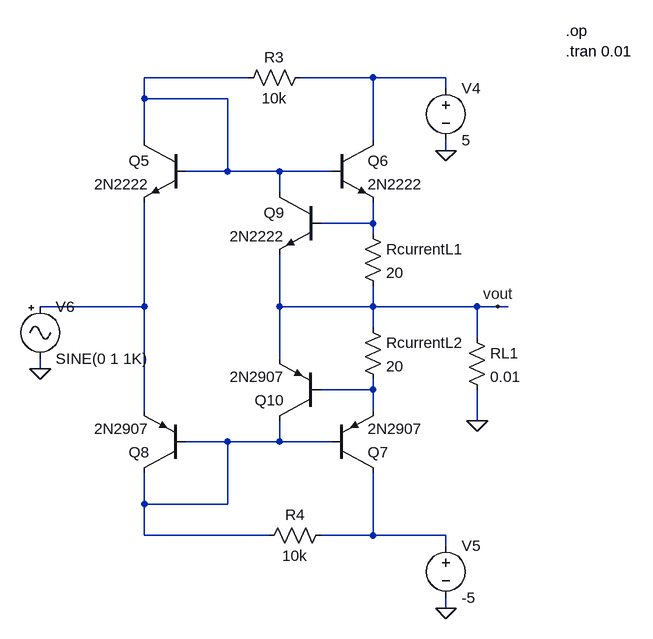
[diagram p0: schematic AB push-pull amplifier.asc]
AB push-pull amplifier.asc, the LTspice schematic file:
Version 4
SHEET 1 1848 848
WIRE 1248 0 1088 0
WIRE 1440 0 1328 0
WIRE 1552 0 1440 0
WIRE 1552 16 1552 0
WIRE 1088 32 1088 0
WIRE 1216 32 1088 32
WIRE 1088 96 1088 32
WIRE 1440 96 1440 0
WIRE 1552 112 1552 96
WIRE 1216 144 1216 32
WIRE 1216 144 1152 144
WIRE 1296 144 1216 144
WIRE 1376 144 1296 144
WIRE 1296 176 1296 144
WIRE 1440 224 1440 192
WIRE 1440 224 1360 224
WIRE 1440 240 1440 224
WIRE 1088 352 1088 192
WIRE 1088 352 928 352
WIRE 1296 352 1296 272
WIRE 1440 352 1440 320
WIRE 1440 352 1296 352
WIRE 1600 352 1440 352
WIRE 1632 352 1600 352
WIRE 1648 352 1632 352
WIRE 1440 384 1440 352
WIRE 1600 400 1600 352
WIRE 1296 432 1296 352
WIRE 928 448 928 432
WIRE 1440 480 1440 464
WIRE 1440 480 1360 480
WIRE 1088 512 1088 352
WIRE 1440 512 1440 480
WIRE 1600 528 1600 480
WIRE 1216 560 1152 560
WIRE 1296 560 1296 528
WIRE 1296 560 1216 560
WIRE 1376 560 1296 560
WIRE 1088 656 1088 608
WIRE 1216 656 1216 560
WIRE 1216 656 1088 656
WIRE 1088 704 1088 656
WIRE 1280 704 1088 704
WIRE 1440 704 1440 608
WIRE 1440 704 1360 704
WIRE 1552 704 1440 704
WIRE 1552 720 1552 704
WIRE 1552 816 1552 800
FLAG 1552 112 0
FLAG 1552 816 0
FLAG 928 448 0
FLAG 1632 352 vout
FLAG 1600 528 0
SYMBOL npn 1152 96 M0
SYMATTR InstName Q5
SYMATTR Value 2N2222
SYMBOL npn 1376 96 R0
SYMATTR InstName Q6
SYMATTR Value 2N2222
SYMBOL pnp 1376 608 M180
SYMATTR InstName Q7
SYMATTR Value 2N2907
SYMBOL pnp 1152 608 R180
SYMATTR InstName Q8
SYMATTR Value 2N2907
SYMBOL res 1344 -16 R90
WINDOW 0 0 56 VBottom 2
WINDOW 3 32 56 VTop 2
SYMATTR InstName R3
SYMATTR Value 10k
SYMBOL res 1376 688 R90
WINDOW 0 0 56 VBottom 2
WINDOW 3 32 56 VTop 2
SYMATTR InstName R4
SYMATTR Value 10k
SYMBOL voltage 1552 0 R0
SYMATTR InstName V4
SYMATTR Value 5
SYMBOL voltage 1552 704 R0
SYMATTR InstName V5
SYMATTR Value -5
SYMBOL Misc/signal 928 336 R0
SYMATTR InstName V6
SYMBOL npn 1360 176 M0
SYMATTR InstName Q9
SYMATTR Value 2N2222
SYMBOL pnp 1360 528 R180
SYMATTR InstName Q10
SYMATTR Value 2N2907
SYMBOL res 1424 224 R0
SYMATTR InstName RcurrentL1
SYMATTR Value 20
SYMBOL res 1424 368 R0
SYMATTR InstName RcurrentL2
SYMATTR Value 20
SYMBOL res 1584 384 R0
SYMATTR InstName RL1
SYMATTR Value 0.01
TEXT 1736 -72 Left 2 !.op\n.tran 0.01

The netlist it stands for:
* AB push-pull amplifier.asc
Q5 N001 N001 N004 0 2N2222
Q6 N002 N001 N003 0 2N2222
Q7 N007 N006 N005 0 2N2907
Q8 N006 N006 N004 0 2N2907
R3 N002 N001 10k
R4 N007 N006 10k
V4 N002 0 5
V5 N007 0 -5
V6 N004 0 SINE(0 1 1K)
Q9 N001 N003 vout 0 2N2222
Q10 N006 N005 vout 0 2N2907
RcurrentL1 N003 vout 20
RcurrentL2 vout N005 20
RL1 vout 0 0.01
.model NPN NPN
.model PNP PNP
.lib standard.bjt
.op
.tran 0.01
.backanno
.end